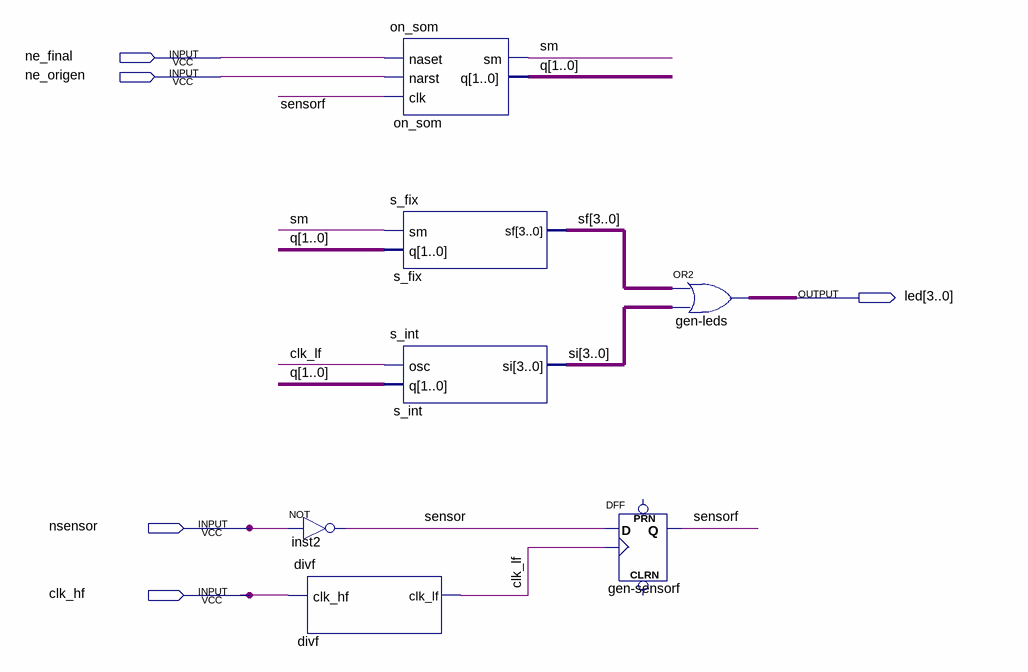
[diagram p0: schematic sheet]
// Quartus schematic metro4.bdf as structural Verilog: 7 symbols, 5 pins
module metro4 (
  input  ne_final,
  input  ne_origen,
  input  nsensor,
  input  clk_hf,
  output [3:0] led
);

  wire clk_lf, sensor, sensorf, sm;
  wire [1:0] q;
  wire [3:0] sf, si;

  not inst2 (sensor, nsensor);
  divf divf (.clk_hf(clk_hf), .clk_lf(clk_lf));
  on_som on_som (.naset(ne_final), .narst(ne_origen), .clk(sensorf), .sm(sm), .q(q));
  s_fix s_fix (.sm(sm), .q(q), .sf(sf));
  s_int s_int (.osc(clk_lf), .q(q), .si(si));
  DFF \gen-sensorf  (.CLK(clk_lf), .D(sensor), .Q(sensorf));  // open: CLRN, PRN
  assign led = sf | si;  // OR2 gen-leds, 4 bits wide
endmodule
